# Altium schematic sheet Sheet3.SchDoc
size A
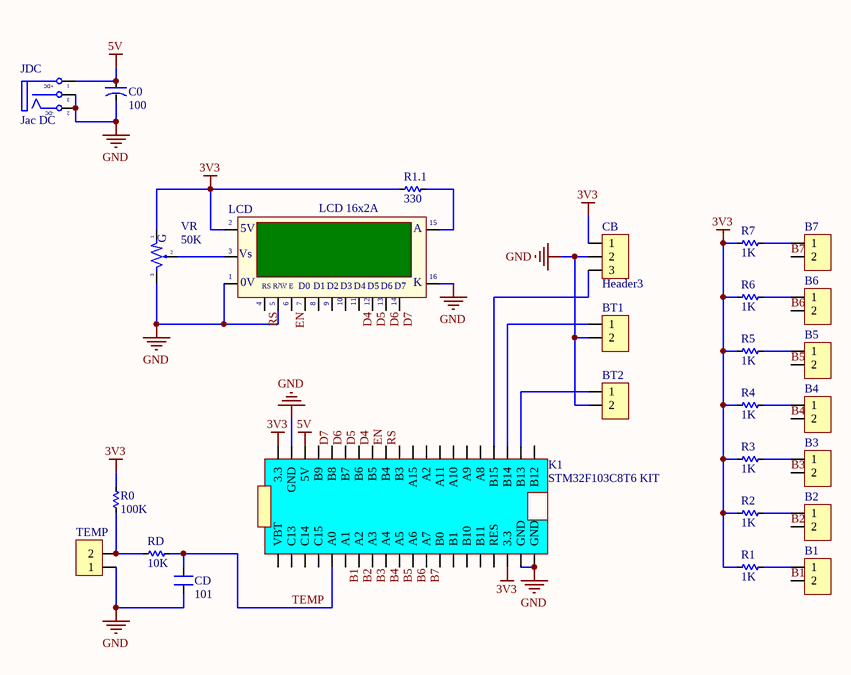
[diagram p0: Sheet3.SchDoc]

## Parts
B1  (no value)  [Header2]
B2  (no value)  [Header2]
B3  (no value)  [Header2]
B4  (no value)  [Header2]
B5  (no value)  [Header2]
B6  (no value)  [Header2]
B7  (no value)  [Header2]
BT1  (no value)  [Header2]
BT2  (no value)  [Header2]
C0  100  [CA-ALU-8]
CB  Header3  [Header3]
CD  101  [CN1.5]
JDC  Jac DC  [DC5]
K1  STM32F103C8T6 KIT  [STM32F103C8T6 KIT]
LCD  LCD 16x2A  [LCD16X2]
R0  100K  [RES-1/4W]
R1  1K  [RES-1/4W]
R1.1  330  [RES-1/4W]
R2  1K  [RES-1/4W]
R3  1K  [RES-1/4W]
R4  1K  [RES-1/4W]
R5  1K  [RES-1/4W]
R6  1K  [RES-1/4W]
R7  1K  [RES-1/4W]
RD  10K  [RES-1/4W]
TEMP  (no value)  [Header2]
VR  50K  [VR-S2]

## Nets
3V3: CB.1 K1.18(3.3) K1.40(3.3) LCD.2(VDD) R0.1 R1.2 R1.1.2 R2.2 R3.2 R4.2 R5.2 R6.2 R7.2 VR.1
5V: C0.1 JDC.1(T) K1.38(5V)
GND: BT1.2 BT2.2 C0.2 CB.2 CD.1 JDC.2(TN) JDC.3(S) K1.19(GND) K1.20(GND) K1.39(GND) LCD.1(GND) LCD.5(R/~{W}) LCD.16(K) TEMP.1 VR.3
B1: B1.2 K1.6(A1)
B2: B2.2 K1.7(A2)
B3: B3.2 K1.8(A3)
B4: B4.2 K1.9(A4)
B5: B5.2 K1.10(A5)
B6: B6.2 K1.11(A6)
B7: B7.2 K1.12(A7)
D4: K1.33(B5) LCD.11(D4)
D5: K1.34(B6) LCD.12(D5)
D6: K1.35(B7) LCD.13(D6)
D7: K1.36(B8) LCD.14(D7)
EN: K1.32(B4) LCD.6(~{EN})
RS: K1.31(B3) LCD.4(RS)
TEMP: CD.2 K1.5(A0) RD.2
NetB1_1: B1.1 R1.1
NetB2_1: B2.1 R2.1
NetB3_1: B3.1 R3.1
NetB4_1: B4.1 R4.1
NetB5_1: B5.1 R5.1
NetB6_1: B6.1 R6.1
NetB7_1: B7.1 R7.1
NetBT1_1: BT1.1 K1.23(B14)
NetBT2_1: BT2.1 K1.22(B13)
NetCB_3: CB.3 K1.24(B15)
NetLCD_3: LCD.3(VEE) VR.2
NetLCD_15: LCD.15(A) R1.1.1
NetR0_2: R0.2 RD.1 TEMP.2

Not connected (* = marked no-connect by the designer): K1 1(VBT) 2(C13) 3(C14) 4(C15) 13(B0) 14(B1) 15(B10) 16(B11) 17(RES) 21(B12) 25(A8) 26(A9) 27(A10) 28(A11) 29(A2) 30(A15) 37(B9); LCD 7(D0) 8(D1) 9(D2) 10(D3)

## Notes on the sheet
- (in symbol DCIN) +DC; -DC
- (in symbol LCD16x2A) 5V; Vs; |; 0V; R/W; E
- (in symbol VR-S) G

## Library data of the parts
B1-B7 BT1 BT2 TEMP = Header2: Header IDC, 2 x 1 Pin Vertical 2.54mm Pitch (Non-Boxed, Male); Manufacturer: W¨¹rth Elektronik eiSos GmbH; partNo: 613002143121; ComponentLink1 Description: Manufacturer; ComponentLink2 Description: Datasheet; NoPins: 02; Created Date: 29 March 2013; ComponentLink1URL: http://www.we-online.com; ComponentLink2URL: http://katalog.we-online.de/em/datasheet/6130xx143121.pdf; Created by: Karrer Zheng
C0 = CN-ALU-DIP: Capacitor (Semiconductor SIM Model); Value: 104; LatestRevisionDate: 17-Jul-2002; LatestRevisionNote: Re-released for DXP Platform.; PackageReference: C1206; Publisher: Altium Limited
CB = Header3: Header IDC, 3 x 1 Pin Vertical 2.54mm Pitch (Non-Boxed, Male); Manufacturer: W¨¹rth Elektronik eiSos GmbH; partNo: 613002143121; ComponentLink1 Description: Manufacturer; ComponentLink2 Description: Datasheet; NoPins: 02; Created Date: 29 March 2013; ComponentLink1URL: http://www.we-online.com; ComponentLink2URL: http://katalog.we-online.de/em/datasheet/6130xx143121.pdf; Created by: Karrer Zheng
CD = CN: Value: 33pF
JDC = DCIN: Jac DC input; Value: Jac DC
LCD = LCD16x2A: LCD dipslay 16 char, 2 line; Value: LCD16x2A
R0 R1 R1.1 R2-R7 RD = Res: Manufacturer: Generic Components; Class: Passive; SubClass: R; Published: 08/06/2000; Publisher: Altium Hobart Technology Centre
VR = VR-S: Var Resistor; Value: Volume 50k